# EAGLE schematic ina826aidr-in-amp (EAGLE 6.4)
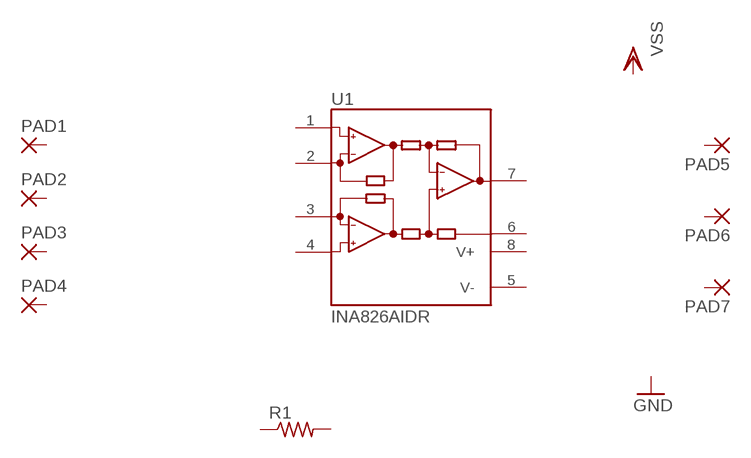
[diagram p0: schematic, sheet 1]

## Parts
PAD1  SMD2  [SMD1,27-2,54]
PAD2  SMD2  [SMD1,27-2,54]
PAD3  SMD2  [SMD1,27-2,54]
PAD4  SMD2  [SMD1,27-2,54]
PAD5  SMD2  [SMD1,27-2,54]
PAD6  SMD2  [SMD1,27-2,54]
PAD7  SMD2  [SMD1,27-2,54]
R1  R-US_R0603  [R0603]
U1  INA826AIDR  [SO08]
Unconnected: PAD1.1(P) PAD2.1(P) PAD3.1(P) PAD4.1(P) PAD5.1(P) PAD6.1(P) PAD7.1(P) R1.1 R1.2 U1.1(-IN) U1.2(RG) U1.3(RG) U1.4(+IN) U1.6(REF) U1.7(OUT)

## Power pins joined to a net without a drawn wire
V+: U1.8(V+)
V-: U1.5(V-)

## Library data of the parts
PAD1-PAD7 = wirepad:SMD2: SMD PAD
R1 = resistor:R-US_: RESISTOR, American symbol
U1 = serge:INA826AIDR